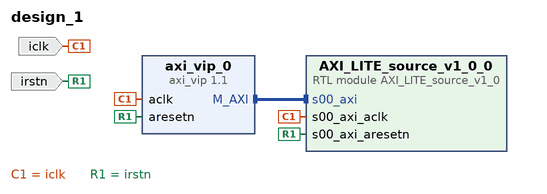
[diagram p0: block diagram of the top level]
# Vivado block design design_1, xczu7ev-ffvc1156-2-e, Vivado 2022.1
create_bd_design design_1

create_bd_port -dir I iclk
create_bd_port -dir I irstn

create_bd_cell -type ip -vlnv xilinx.com:ip:axi_vip:1.1 axi_vip_0
set_property -dict [list \
  CONFIG.ADDR_WIDTH 32 \
  CONFIG.DATA_WIDTH 32 \
  CONFIG.HAS_BRESP 1 \
  CONFIG.HAS_PROT 1 \
  CONFIG.HAS_RRESP 1 \
  CONFIG.HAS_WSTRB 1 \
  CONFIG.INTERFACE_MODE MASTER \
  CONFIG.PROTOCOL AXI4LITE \
  CONFIG.READ_WRITE_MODE READ_WRITE \
] [get_bd_cells axi_vip_0]
create_bd_cell -type module -reference AXI_LITE_source_v1_0 AXI_LITE_source_v1_0_0

# ---- connections ----

connect_bd_intf_net [get_bd_intf_pins axi_vip_0/M_AXI] [get_bd_intf_pins AXI_LITE_source_v1_0_0/s00_axi]
connect_bd_net [get_bd_ports iclk] [get_bd_pins axi_vip_0/aclk] [get_bd_pins AXI_LITE_source_v1_0_0/s00_axi_aclk]
connect_bd_net [get_bd_ports irstn] [get_bd_pins axi_vip_0/aresetn] [get_bd_pins AXI_LITE_source_v1_0_0/s00_axi_aresetn]

validate_bd_design
save_bd_design
